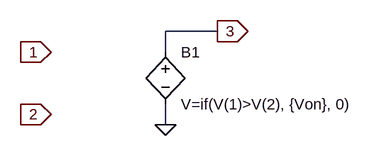
[diagram p0: schematic compare.asc]
compare.asc, the LTspice schematic file:
Version 4
SHEET 1 880 680
WIRE 384 80 304 80
WIRE 304 112 304 80
WIRE 304 224 304 192
FLAG 128 112 1
IOPIN 128 112 In
FLAG 128 208 2
IOPIN 128 208 In
FLAG 304 224 0
FLAG 384 80 3
IOPIN 384 80 Out
SYMBOL bv 304 96 R0
SYMATTR InstName B1
SYMATTR Value V=if(V(1)>V(2), {Von}, 0)

The netlist it stands for:
* compare.asc
B1 3 0 V=if(V(1)>V(2), {Von}, 0)
.backanno
.end